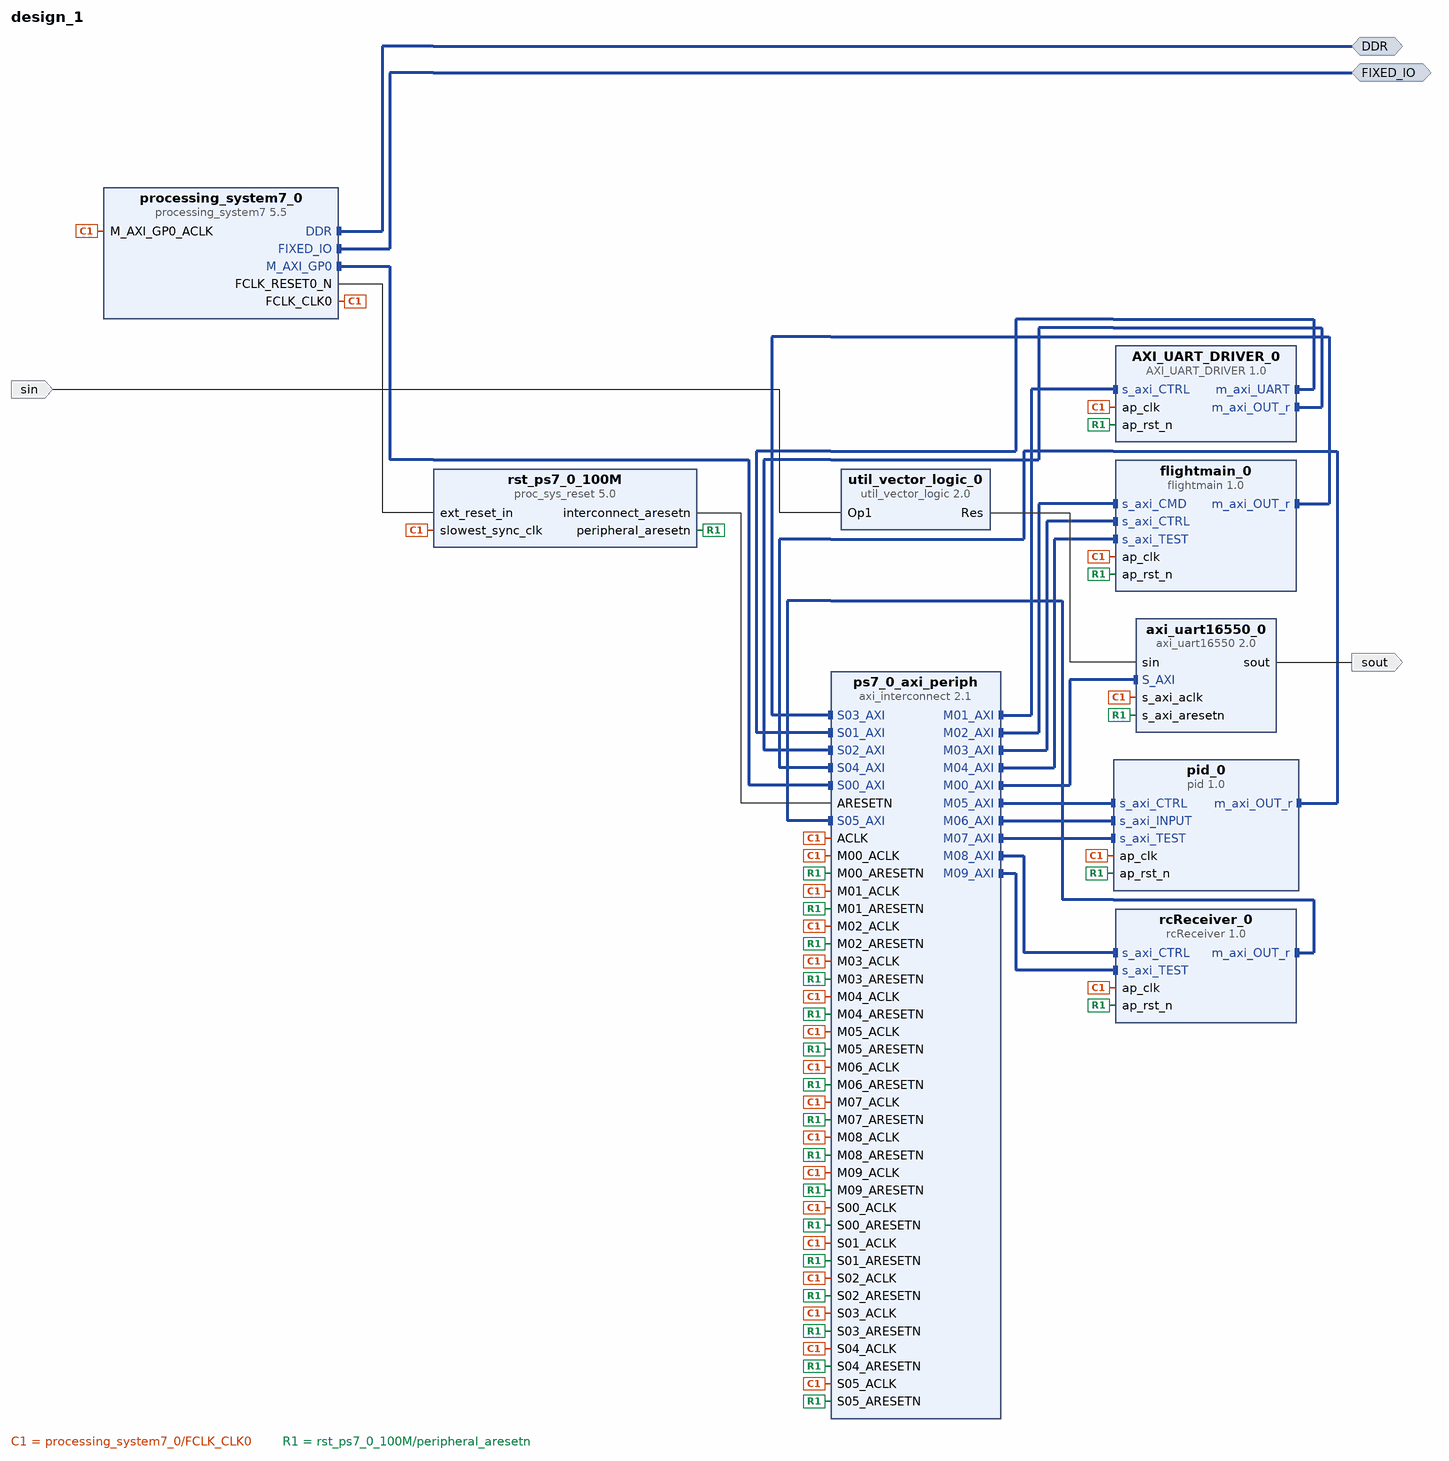
[diagram p0: block diagram of the top level]
# Vivado block design design_1, xc7z020clg400-1, Vivado 2018.2
create_bd_design design_1

create_bd_intf_port -mode Master -vlnv xilinx.com:interface:ddrx_rtl:1.0 DDR
create_bd_intf_port -mode Master -vlnv xilinx.com:display_processing_system7:fixedio_rtl:1.0 FIXED_IO
create_bd_port -dir O -type data sout
create_bd_port -dir I -type data sin

create_bd_cell -type ip -vlnv xilinx.com:ip:processing_system7:5.5 processing_system7_0
set_property -dict [list \
  CONFIG.PCW_CRYSTAL_PERIPHERAL_FREQMHZ 50 \
  CONFIG.PCW_FPGA0_PERIPHERAL_FREQMHZ 100 \
  CONFIG.PCW_FPGA1_PERIPHERAL_FREQMHZ 100 \
  CONFIG.PCW_FPGA2_PERIPHERAL_FREQMHZ 100 \
  CONFIG.PCW_FPGA3_PERIPHERAL_FREQMHZ 100 \
  CONFIG.PCW_OVERRIDE_BASIC_CLOCK 1 \
] [get_bd_cells processing_system7_0]
# 60 more settings of processing_system7_0 are not shown: defaults, MIO pin electricals, DDR timing, and values the tool derives
create_bd_cell -type ip -vlnv xilinx.com:ip:axi_uart16550:2.0 axi_uart16550_0
create_bd_cell -type ip -vlnv xilinx.com:ip:util_vector_logic:2.0 util_vector_logic_0
set_property -dict {CONFIG.C_SIZE 1 CONFIG.C_OPERATION not} [get_bd_cells util_vector_logic_0]
create_bd_cell -type ip -vlnv xilinx.com:hls:AXI_UART_DRIVER:1.0 AXI_UART_DRIVER_0
set_property -dict [list \
  CONFIG.C_M_AXI_UART_TARGET_ADDR 0x43C00000 \
  CONFIG.C_M_AXI_OUT_R_TARGET_ADDR 0x40000020 \
] [get_bd_cells AXI_UART_DRIVER_0]
create_bd_cell -type ip -vlnv xilinx.com:ip:proc_sys_reset:5.0 rst_ps7_0_100M
create_bd_cell -type ip -vlnv xilinx.com:ip:axi_interconnect:2.1 ps7_0_axi_periph
set_property -dict {CONFIG.NUM_SI 6 CONFIG.NUM_MI 10} [get_bd_cells ps7_0_axi_periph]
create_bd_cell -type ip -vlnv xilinx.com:hls:flightmain:1.0 flightmain_0
set_property -dict {CONFIG.C_M_AXI_OUT_R_TARGET_ADDR 0x40040010} [get_bd_cells flightmain_0]
create_bd_cell -type ip -vlnv xilinx.com:hls:rcReceiver:1.0 rcReceiver_0
set_property -dict {CONFIG.C_M_AXI_OUT_R_TARGET_ADDR 0x40020010} [get_bd_cells rcReceiver_0]
create_bd_cell -type ip -vlnv xilinx.com:hls:pid:1.0 pid_0

# ---- connections ----

connect_bd_intf_net [get_bd_intf_pins processing_system7_0/M_AXI_GP0] [get_bd_intf_pins ps7_0_axi_periph/S00_AXI]
connect_bd_intf_net [get_bd_intf_pins ps7_0_axi_periph/M00_AXI] [get_bd_intf_pins axi_uart16550_0/S_AXI]
connect_bd_intf_net [get_bd_intf_pins ps7_0_axi_periph/M01_AXI] [get_bd_intf_pins AXI_UART_DRIVER_0/s_axi_CTRL]
connect_bd_intf_net [get_bd_intf_pins ps7_0_axi_periph/M02_AXI] [get_bd_intf_pins flightmain_0/s_axi_CMD]
connect_bd_intf_net [get_bd_intf_pins ps7_0_axi_periph/M03_AXI] [get_bd_intf_pins flightmain_0/s_axi_CTRL]
connect_bd_intf_net [get_bd_intf_pins ps7_0_axi_periph/M04_AXI] [get_bd_intf_pins flightmain_0/s_axi_TEST]
connect_bd_intf_net [get_bd_intf_pins ps7_0_axi_periph/M05_AXI] [get_bd_intf_pins pid_0/s_axi_CTRL]
connect_bd_intf_net [get_bd_intf_pins ps7_0_axi_periph/M06_AXI] [get_bd_intf_pins pid_0/s_axi_INPUT]
connect_bd_intf_net [get_bd_intf_pins ps7_0_axi_periph/M07_AXI] [get_bd_intf_pins pid_0/s_axi_TEST]
connect_bd_intf_net [get_bd_intf_pins ps7_0_axi_periph/M08_AXI] [get_bd_intf_pins rcReceiver_0/s_axi_CTRL]
connect_bd_intf_net [get_bd_intf_pins ps7_0_axi_periph/M09_AXI] [get_bd_intf_pins rcReceiver_0/s_axi_TEST]
connect_bd_intf_net [get_bd_intf_pins AXI_UART_DRIVER_0/m_axi_UART] [get_bd_intf_pins ps7_0_axi_periph/S01_AXI]
connect_bd_intf_net [get_bd_intf_pins AXI_UART_DRIVER_0/m_axi_OUT_r] [get_bd_intf_pins ps7_0_axi_periph/S02_AXI]
connect_bd_intf_net [get_bd_intf_pins flightmain_0/m_axi_OUT_r] [get_bd_intf_pins ps7_0_axi_periph/S03_AXI]
connect_bd_intf_net [get_bd_intf_pins pid_0/m_axi_OUT_r] [get_bd_intf_pins ps7_0_axi_periph/S04_AXI]
connect_bd_intf_net [get_bd_intf_pins rcReceiver_0/m_axi_OUT_r] [get_bd_intf_pins ps7_0_axi_periph/S05_AXI]
connect_bd_intf_net [get_bd_intf_ports DDR] [get_bd_intf_pins processing_system7_0/DDR]
connect_bd_intf_net [get_bd_intf_ports FIXED_IO] [get_bd_intf_pins processing_system7_0/FIXED_IO]
connect_bd_net [get_bd_pins axi_uart16550_0/sout] [get_bd_ports sout]
connect_bd_net [get_bd_pins processing_system7_0/FCLK_CLK0] \
  [get_bd_pins processing_system7_0/M_AXI_GP0_ACLK] [get_bd_pins axi_uart16550_0/s_axi_aclk] \
  [get_bd_pins AXI_UART_DRIVER_0/ap_clk] [get_bd_pins rst_ps7_0_100M/slowest_sync_clk] [get_bd_pins ps7_0_axi_periph/ACLK] \
  [get_bd_pins ps7_0_axi_periph/S00_ACLK] [get_bd_pins ps7_0_axi_periph/M00_ACLK] [get_bd_pins ps7_0_axi_periph/M01_ACLK] \
  [get_bd_pins ps7_0_axi_periph/M02_ACLK] [get_bd_pins ps7_0_axi_periph/M03_ACLK] [get_bd_pins ps7_0_axi_periph/M04_ACLK] \
  [get_bd_pins ps7_0_axi_periph/M05_ACLK] [get_bd_pins ps7_0_axi_periph/M06_ACLK] [get_bd_pins ps7_0_axi_periph/M07_ACLK] \
  [get_bd_pins ps7_0_axi_periph/M08_ACLK] [get_bd_pins ps7_0_axi_periph/M09_ACLK] [get_bd_pins ps7_0_axi_periph/S01_ACLK] \
  [get_bd_pins ps7_0_axi_periph/S02_ACLK] [get_bd_pins ps7_0_axi_periph/S03_ACLK] [get_bd_pins ps7_0_axi_periph/S04_ACLK] \
  [get_bd_pins ps7_0_axi_periph/S05_ACLK] [get_bd_pins flightmain_0/ap_clk] [get_bd_pins rcReceiver_0/ap_clk] \
  [get_bd_pins pid_0/ap_clk]
connect_bd_net [get_bd_pins util_vector_logic_0/Res] [get_bd_pins axi_uart16550_0/sin]
connect_bd_net [get_bd_ports sin] [get_bd_pins util_vector_logic_0/Op1]
connect_bd_net [get_bd_pins processing_system7_0/FCLK_RESET0_N] [get_bd_pins rst_ps7_0_100M/ext_reset_in]
connect_bd_net [get_bd_pins rst_ps7_0_100M/peripheral_aresetn] \
  [get_bd_pins axi_uart16550_0/s_axi_aresetn] [get_bd_pins AXI_UART_DRIVER_0/ap_rst_n] \
  [get_bd_pins ps7_0_axi_periph/S00_ARESETN] [get_bd_pins ps7_0_axi_periph/M00_ARESETN] \
  [get_bd_pins ps7_0_axi_periph/M01_ARESETN] [get_bd_pins ps7_0_axi_periph/M02_ARESETN] \
  [get_bd_pins ps7_0_axi_periph/M03_ARESETN] [get_bd_pins ps7_0_axi_periph/M04_ARESETN] \
  [get_bd_pins ps7_0_axi_periph/M05_ARESETN] [get_bd_pins ps7_0_axi_periph/M06_ARESETN] \
  [get_bd_pins ps7_0_axi_periph/M07_ARESETN] [get_bd_pins ps7_0_axi_periph/M08_ARESETN] \
  [get_bd_pins ps7_0_axi_periph/M09_ARESETN] [get_bd_pins ps7_0_axi_periph/S01_ARESETN] \
  [get_bd_pins ps7_0_axi_periph/S02_ARESETN] [get_bd_pins ps7_0_axi_periph/S03_ARESETN] \
  [get_bd_pins ps7_0_axi_periph/S04_ARESETN] [get_bd_pins ps7_0_axi_periph/S05_ARESETN] [get_bd_pins flightmain_0/ap_rst_n] \
  [get_bd_pins rcReceiver_0/ap_rst_n] [get_bd_pins pid_0/ap_rst_n]
connect_bd_net [get_bd_pins rst_ps7_0_100M/interconnect_aresetn] [get_bd_pins ps7_0_axi_periph/ARESETN]

# ---- address map ----
assign_bd_address -offset 0x40000000 -range 4K -target_address_space [get_bd_addr_spaces AXI_UART_DRIVER_0/Data_m_axi_OUT_r] [get_bd_addr_segs rcReceiver_0/s_axi_CTRL/Reg]
exclude_bd_addr_seg -offset 0x40004000 -range 16K -target_address_space [get_bd_addr_spaces AXI_UART_DRIVER_0/Data_m_axi_OUT_r] [get_bd_addr_segs rcReceiver_0/s_axi_TEST/Reg]
exclude_bd_addr_seg -offset 0x40010000 -range 4K -target_address_space [get_bd_addr_spaces AXI_UART_DRIVER_0/Data_m_axi_OUT_r] [get_bd_addr_segs flightmain_0/s_axi_CTRL/Reg]
exclude_bd_addr_seg -offset 0x40020000 -range 4K -target_address_space [get_bd_addr_spaces AXI_UART_DRIVER_0/Data_m_axi_OUT_r] [get_bd_addr_segs flightmain_0/s_axi_CMD/Reg]
exclude_bd_addr_seg -offset 0x40030000 -range 4K -target_address_space [get_bd_addr_spaces AXI_UART_DRIVER_0/Data_m_axi_OUT_r] [get_bd_addr_segs pid_0/s_axi_CTRL/Reg]
exclude_bd_addr_seg -offset 0x40040000 -range 4K -target_address_space [get_bd_addr_spaces AXI_UART_DRIVER_0/Data_m_axi_OUT_r] [get_bd_addr_segs pid_0/s_axi_INPUT/Reg]
exclude_bd_addr_seg -offset 0x40054000 -range 16K -target_address_space [get_bd_addr_spaces AXI_UART_DRIVER_0/Data_m_axi_OUT_r] [get_bd_addr_segs pid_0/s_axi_TEST/Reg]
exclude_bd_addr_seg -offset 0x40064000 -range 16K -target_address_space [get_bd_addr_spaces AXI_UART_DRIVER_0/Data_m_axi_OUT_r] [get_bd_addr_segs flightmain_0/s_axi_TEST/Reg]
exclude_bd_addr_seg -offset 0x43C00000 -range 64K -target_address_space [get_bd_addr_spaces AXI_UART_DRIVER_0/Data_m_axi_OUT_r] [get_bd_addr_segs axi_uart16550_0/S_AXI/Reg]
exclude_bd_addr_seg -offset 0x43C10000 -range 4K -target_address_space [get_bd_addr_spaces AXI_UART_DRIVER_0/Data_m_axi_OUT_r] [get_bd_addr_segs AXI_UART_DRIVER_0/s_axi_CTRL/Reg]
assign_bd_address -offset 0x43C00000 -range 64K -target_address_space [get_bd_addr_spaces AXI_UART_DRIVER_0/Data_m_axi_UART] [get_bd_addr_segs axi_uart16550_0/S_AXI/Reg]
exclude_bd_addr_seg -offset 0x40000000 -range 4K -target_address_space [get_bd_addr_spaces AXI_UART_DRIVER_0/Data_m_axi_UART] [get_bd_addr_segs rcReceiver_0/s_axi_CTRL/Reg]
exclude_bd_addr_seg -offset 0x40004000 -range 16K -target_address_space [get_bd_addr_spaces AXI_UART_DRIVER_0/Data_m_axi_UART] [get_bd_addr_segs rcReceiver_0/s_axi_TEST/Reg]
exclude_bd_addr_seg -offset 0x40010000 -range 4K -target_address_space [get_bd_addr_spaces AXI_UART_DRIVER_0/Data_m_axi_UART] [get_bd_addr_segs flightmain_0/s_axi_CTRL/Reg]
exclude_bd_addr_seg -offset 0x40020000 -range 4K -target_address_space [get_bd_addr_spaces AXI_UART_DRIVER_0/Data_m_axi_UART] [get_bd_addr_segs flightmain_0/s_axi_CMD/Reg]
exclude_bd_addr_seg -offset 0x40030000 -range 4K -target_address_space [get_bd_addr_spaces AXI_UART_DRIVER_0/Data_m_axi_UART] [get_bd_addr_segs pid_0/s_axi_CTRL/Reg]
exclude_bd_addr_seg -offset 0x40040000 -range 4K -target_address_space [get_bd_addr_spaces AXI_UART_DRIVER_0/Data_m_axi_UART] [get_bd_addr_segs pid_0/s_axi_INPUT/Reg]
exclude_bd_addr_seg -offset 0x40054000 -range 16K -target_address_space [get_bd_addr_spaces AXI_UART_DRIVER_0/Data_m_axi_UART] [get_bd_addr_segs pid_0/s_axi_TEST/Reg]
exclude_bd_addr_seg -offset 0x40064000 -range 16K -target_address_space [get_bd_addr_spaces AXI_UART_DRIVER_0/Data_m_axi_UART] [get_bd_addr_segs flightmain_0/s_axi_TEST/Reg]
exclude_bd_addr_seg -offset 0x43C10000 -range 4K -target_address_space [get_bd_addr_spaces AXI_UART_DRIVER_0/Data_m_axi_UART] [get_bd_addr_segs AXI_UART_DRIVER_0/s_axi_CTRL/Reg]
assign_bd_address -offset 0x40040000 -range 4K -target_address_space [get_bd_addr_spaces flightmain_0/Data_m_axi_OUT_r] [get_bd_addr_segs pid_0/s_axi_INPUT/Reg]
exclude_bd_addr_seg -offset 0x40000000 -range 4K -target_address_space [get_bd_addr_spaces flightmain_0/Data_m_axi_OUT_r] [get_bd_addr_segs rcReceiver_0/s_axi_CTRL/Reg]
exclude_bd_addr_seg -offset 0x40004000 -range 16K -target_address_space [get_bd_addr_spaces flightmain_0/Data_m_axi_OUT_r] [get_bd_addr_segs rcReceiver_0/s_axi_TEST/Reg]
exclude_bd_addr_seg -offset 0x40010000 -range 4K -target_address_space [get_bd_addr_spaces flightmain_0/Data_m_axi_OUT_r] [get_bd_addr_segs flightmain_0/s_axi_CTRL/Reg]
exclude_bd_addr_seg -offset 0x40020000 -range 4K -target_address_space [get_bd_addr_spaces flightmain_0/Data_m_axi_OUT_r] [get_bd_addr_segs flightmain_0/s_axi_CMD/Reg]
exclude_bd_addr_seg -offset 0x40030000 -range 4K -target_address_space [get_bd_addr_spaces flightmain_0/Data_m_axi_OUT_r] [get_bd_addr_segs pid_0/s_axi_CTRL/Reg]
exclude_bd_addr_seg -offset 0x40054000 -range 16K -target_address_space [get_bd_addr_spaces flightmain_0/Data_m_axi_OUT_r] [get_bd_addr_segs pid_0/s_axi_TEST/Reg]
exclude_bd_addr_seg -offset 0x40064000 -range 16K -target_address_space [get_bd_addr_spaces flightmain_0/Data_m_axi_OUT_r] [get_bd_addr_segs flightmain_0/s_axi_TEST/Reg]
exclude_bd_addr_seg -offset 0x43C00000 -range 64K -target_address_space [get_bd_addr_spaces flightmain_0/Data_m_axi_OUT_r] [get_bd_addr_segs axi_uart16550_0/S_AXI/Reg]
exclude_bd_addr_seg -offset 0x43C10000 -range 4K -target_address_space [get_bd_addr_spaces flightmain_0/Data_m_axi_OUT_r] [get_bd_addr_segs AXI_UART_DRIVER_0/s_axi_CTRL/Reg]
assign_bd_address -offset 0x40020000 -range 4K -target_address_space [get_bd_addr_spaces pid_0/Data_m_axi_OUT_r] [get_bd_addr_segs flightmain_0/s_axi_CMD/Reg]
exclude_bd_addr_seg -offset 0x40000000 -range 4K -target_address_space [get_bd_addr_spaces pid_0/Data_m_axi_OUT_r] [get_bd_addr_segs rcReceiver_0/s_axi_CTRL/Reg]
exclude_bd_addr_seg -offset 0x40004000 -range 16K -target_address_space [get_bd_addr_spaces pid_0/Data_m_axi_OUT_r] [get_bd_addr_segs rcReceiver_0/s_axi_TEST/Reg]
exclude_bd_addr_seg -offset 0x40010000 -range 4K -target_address_space [get_bd_addr_spaces pid_0/Data_m_axi_OUT_r] [get_bd_addr_segs flightmain_0/s_axi_CTRL/Reg]
exclude_bd_addr_seg -offset 0x40030000 -range 4K -target_address_space [get_bd_addr_spaces pid_0/Data_m_axi_OUT_r] [get_bd_addr_segs pid_0/s_axi_CTRL/Reg]
exclude_bd_addr_seg -offset 0x40040000 -range 4K -target_address_space [get_bd_addr_spaces pid_0/Data_m_axi_OUT_r] [get_bd_addr_segs pid_0/s_axi_INPUT/Reg]
exclude_bd_addr_seg -offset 0x40054000 -range 16K -target_address_space [get_bd_addr_spaces pid_0/Data_m_axi_OUT_r] [get_bd_addr_segs pid_0/s_axi_TEST/Reg]
exclude_bd_addr_seg -offset 0x40064000 -range 16K -target_address_space [get_bd_addr_spaces pid_0/Data_m_axi_OUT_r] [get_bd_addr_segs flightmain_0/s_axi_TEST/Reg]
exclude_bd_addr_seg -offset 0x43C00000 -range 64K -target_address_space [get_bd_addr_spaces pid_0/Data_m_axi_OUT_r] [get_bd_addr_segs axi_uart16550_0/S_AXI/Reg]
exclude_bd_addr_seg -offset 0x43C10000 -range 4K -target_address_space [get_bd_addr_spaces pid_0/Data_m_axi_OUT_r] [get_bd_addr_segs AXI_UART_DRIVER_0/s_axi_CTRL/Reg]
assign_bd_address -offset 0x40000000 -range 4K -target_address_space [get_bd_addr_spaces processing_system7_0/Data] [get_bd_addr_segs rcReceiver_0/s_axi_CTRL/Reg]
assign_bd_address -offset 0x40004000 -range 16K -target_address_space [get_bd_addr_spaces processing_system7_0/Data] [get_bd_addr_segs rcReceiver_0/s_axi_TEST/Reg]
assign_bd_address -offset 0x40010000 -range 4K -target_address_space [get_bd_addr_spaces processing_system7_0/Data] [get_bd_addr_segs flightmain_0/s_axi_CTRL/Reg]
assign_bd_address -offset 0x40020000 -range 4K -target_address_space [get_bd_addr_spaces processing_system7_0/Data] [get_bd_addr_segs flightmain_0/s_axi_CMD/Reg]
assign_bd_address -offset 0x40030000 -range 4K -target_address_space [get_bd_addr_spaces processing_system7_0/Data] [get_bd_addr_segs pid_0/s_axi_CTRL/Reg]
assign_bd_address -offset 0x40040000 -range 4K -target_address_space [get_bd_addr_spaces processing_system7_0/Data] [get_bd_addr_segs pid_0/s_axi_INPUT/Reg]
assign_bd_address -offset 0x40054000 -range 16K -target_address_space [get_bd_addr_spaces processing_system7_0/Data] [get_bd_addr_segs pid_0/s_axi_TEST/Reg]
assign_bd_address -offset 0x40064000 -range 16K -target_address_space [get_bd_addr_spaces processing_system7_0/Data] [get_bd_addr_segs flightmain_0/s_axi_TEST/Reg]
assign_bd_address -offset 0x43C00000 -range 64K -target_address_space [get_bd_addr_spaces processing_system7_0/Data] [get_bd_addr_segs axi_uart16550_0/S_AXI/Reg]
assign_bd_address -offset 0x43C10000 -range 4K -target_address_space [get_bd_addr_spaces processing_system7_0/Data] [get_bd_addr_segs AXI_UART_DRIVER_0/s_axi_CTRL/Reg]
assign_bd_address -offset 0x40020000 -range 4K -target_address_space [get_bd_addr_spaces rcReceiver_0/Data_m_axi_OUT_r] [get_bd_addr_segs flightmain_0/s_axi_CMD/Reg]
exclude_bd_addr_seg -offset 0x40000000 -range 4K -target_address_space [get_bd_addr_spaces rcReceiver_0/Data_m_axi_OUT_r] [get_bd_addr_segs rcReceiver_0/s_axi_CTRL/Reg]
exclude_bd_addr_seg -offset 0x40004000 -range 16K -target_address_space [get_bd_addr_spaces rcReceiver_0/Data_m_axi_OUT_r] [get_bd_addr_segs rcReceiver_0/s_axi_TEST/Reg]
exclude_bd_addr_seg -offset 0x40010000 -range 4K -target_address_space [get_bd_addr_spaces rcReceiver_0/Data_m_axi_OUT_r] [get_bd_addr_segs flightmain_0/s_axi_CTRL/Reg]
exclude_bd_addr_seg -offset 0x40030000 -range 4K -target_address_space [get_bd_addr_spaces rcReceiver_0/Data_m_axi_OUT_r] [get_bd_addr_segs pid_0/s_axi_CTRL/Reg]
exclude_bd_addr_seg -offset 0x40040000 -range 4K -target_address_space [get_bd_addr_spaces rcReceiver_0/Data_m_axi_OUT_r] [get_bd_addr_segs pid_0/s_axi_INPUT/Reg]
exclude_bd_addr_seg -offset 0x40054000 -range 16K -target_address_space [get_bd_addr_spaces rcReceiver_0/Data_m_axi_OUT_r] [get_bd_addr_segs pid_0/s_axi_TEST/Reg]
exclude_bd_addr_seg -offset 0x40064000 -range 16K -target_address_space [get_bd_addr_spaces rcReceiver_0/Data_m_axi_OUT_r] [get_bd_addr_segs flightmain_0/s_axi_TEST/Reg]
exclude_bd_addr_seg -offset 0x43C00000 -range 64K -target_address_space [get_bd_addr_spaces rcReceiver_0/Data_m_axi_OUT_r] [get_bd_addr_segs axi_uart16550_0/S_AXI/Reg]
exclude_bd_addr_seg -offset 0x43C10000 -range 4K -target_address_space [get_bd_addr_spaces rcReceiver_0/Data_m_axi_OUT_r] [get_bd_addr_segs AXI_UART_DRIVER_0/s_axi_CTRL/Reg]

validate_bd_design
save_bd_design
